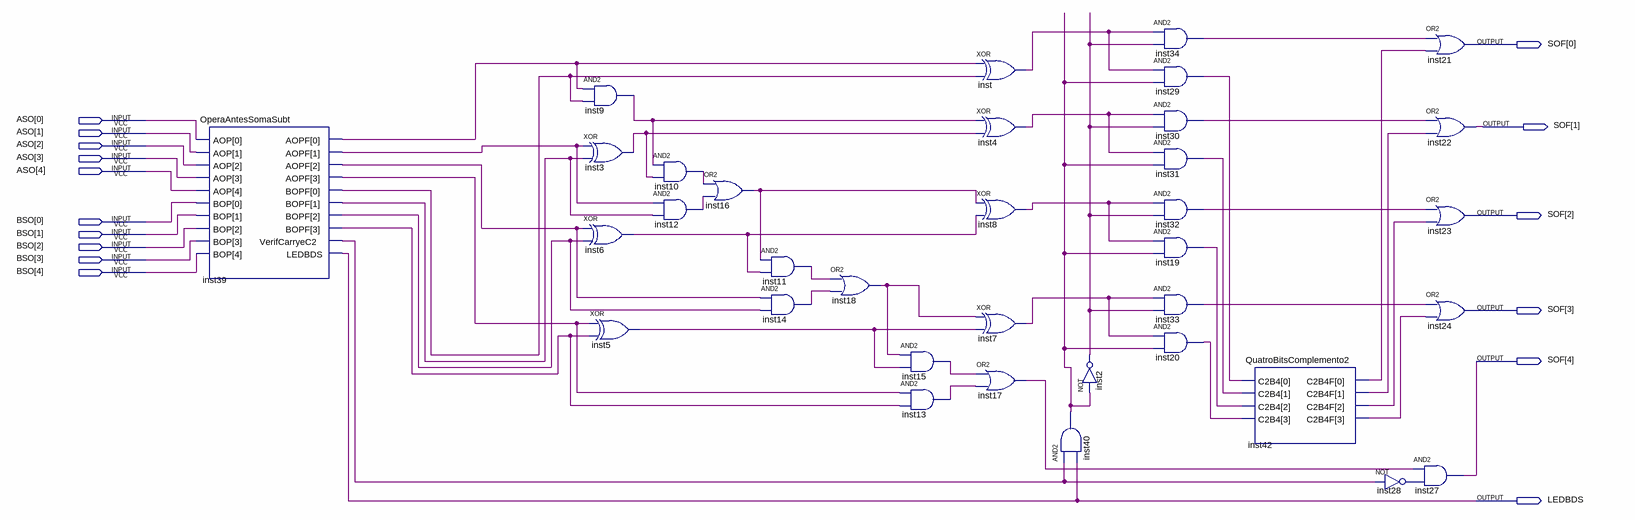
[diagram p0: schematic sheet]
// Quartus schematic Somador.bdf as structural Verilog: 35 symbols, 16 pins
module Somador (
  input  [4:0] ASO,
  input  [4:0] BSO,
  output [4:0] SOF,
  output LEDBDS
);

  wire inst2_out, inst3_out, inst4_out, inst5_out, inst6_out, inst7_out, inst8_out, inst9_out, inst10_out,
       inst11_out, inst12_out, inst13_out, inst14_out, inst15_out, inst16_out, inst17_out, inst18_out,
       inst19_out, inst20_out, inst28_out, inst29_out, inst30_out, inst31_out, inst32_out, inst33_out,
       inst34_out, inst39_aopf, inst39_aopf_2, inst39_aopf_3, inst39_aopf_4, inst39_bopf, inst39_bopf_2,
       inst39_bopf_3, inst39_bopf_4, inst39_verifcarryec2, inst40_out, inst42_c2b4f, inst42_c2b4f_2,
       inst42_c2b4f_3, inst42_c2b4f_4, inst_out;

  OperaAntesSomaSubt inst39 (
    .AOP(ASO), .BOP(BSO), .AOPF({inst39_aopf_4, inst39_aopf_3, inst39_aopf, inst39_aopf_2}),
    .BOPF({inst39_bopf_2, inst39_bopf, inst39_bopf_3, inst39_bopf_4}), .VerifCarryeC2(inst39_verifcarryec2),
    .LEDBDS(LEDBDS));
  and inst9 (inst9_out, inst39_aopf_2, inst39_bopf_4);
  xor inst3 (inst3_out, inst39_aopf, inst39_bopf_3);
  xor inst6 (inst6_out, inst39_aopf_3, inst39_bopf);
  xor inst5 (inst5_out, inst39_aopf_4, inst39_bopf_2);
  and inst10 (inst10_out, inst9_out, inst3_out);
  and inst12 (inst12_out, inst39_aopf, inst39_bopf_3);
  or inst16 (inst16_out, inst10_out, inst12_out);
  and inst11 (inst11_out, inst16_out, inst6_out);
  and inst14 (inst14_out, inst39_aopf_3, inst39_bopf);
  or inst18 (inst18_out, inst11_out, inst14_out);
  and inst15 (inst15_out, inst18_out, inst5_out);
  and inst13 (inst13_out, inst39_aopf_4, inst39_bopf_2);
  xor inst (inst_out, inst39_aopf_2, inst39_bopf_4);
  xor inst4 (inst4_out, inst9_out, inst3_out);
  xor inst8 (inst8_out, inst16_out, inst6_out);
  xor inst7 (inst7_out, inst18_out, inst5_out);
  or inst17 (inst17_out, inst15_out, inst13_out);
  and inst40 (inst40_out, inst39_verifcarryec2, LEDBDS);
  not inst2 (inst2_out, inst40_out);
  and inst34 (inst34_out, inst_out, inst2_out);
  and inst29 (inst29_out, inst_out, inst40_out);
  and inst30 (inst30_out, inst4_out, inst2_out);
  and inst31 (inst31_out, inst4_out, inst40_out);
  and inst32 (inst32_out, inst8_out, inst2_out);
  and inst19 (inst19_out, inst8_out, inst40_out);
  and inst33 (inst33_out, inst7_out, inst2_out);
  and inst20 (inst20_out, inst7_out, inst40_out);
  QuatroBitsComplemento2 inst42 (
    .C2B4({inst20_out, inst19_out, inst31_out, inst29_out}),
    .C2B4F({inst42_c2b4f_4, inst42_c2b4f_3, inst42_c2b4f, inst42_c2b4f_2}));
  not inst28 (inst28_out, inst39_verifcarryec2);
  or inst21 (SOF[0], inst34_out, inst42_c2b4f_2);
  or inst22 (SOF[1], inst30_out, inst42_c2b4f);
  or inst23 (SOF[2], inst32_out, inst42_c2b4f_3);
  or inst24 (SOF[3], inst33_out, inst42_c2b4f_4);
  and inst27 (SOF[4], inst17_out, inst28_out);
endmodule
